# Altium schematic sheet Power.SchDoc
size A; SheetNumber: 1; SheetTotal: 4
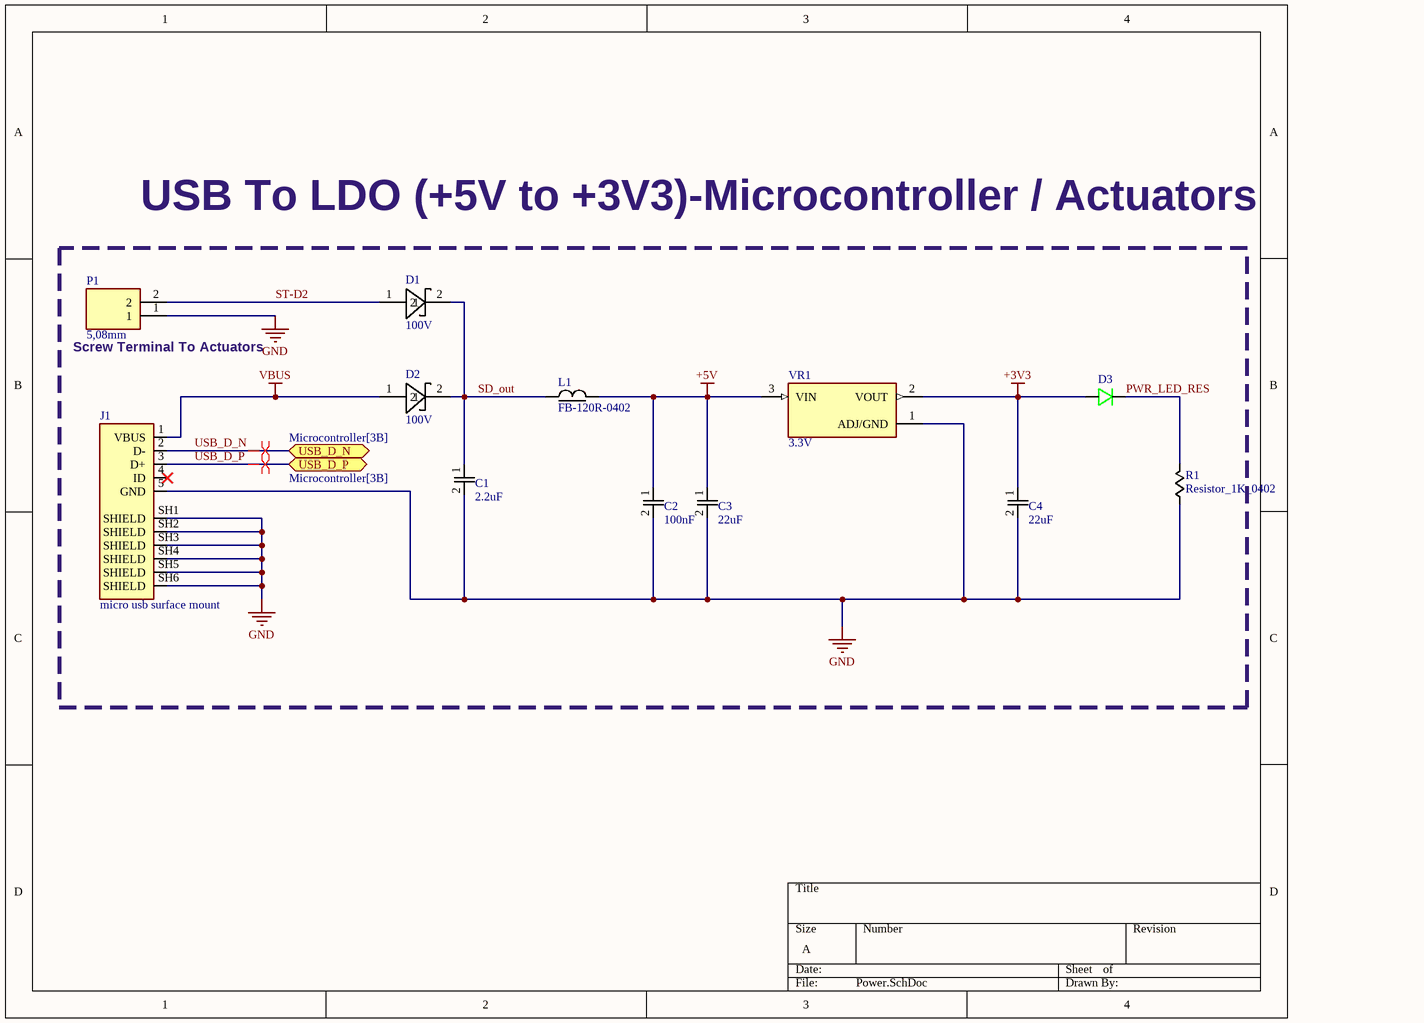
[diagram p0: Power.SchDoc]

## Parts
C1  2.2uF  [CAPC1005X55N]
C2  100nF  [CAPC1005X55N]
C3  22uF  [CAPC1005X55N]
C4  22uF  [CAPC1005X55N]
D1  100V  [Schottky.D]
D2  100V  [Schottky.D]
D3  Green LED 0805  [LED_APT2012MGC]  (value not drawn)
J1  micro usb surface mount  [TE_1981568-1]
L1  FB-120R-0402  [RESC1005X40N]
P1  5,08mm  [Screw_terminal_block_5.0]
R1  Resistor_1K_0402  [RESC1005X40N]
VR1  3.3V  [SOT229P700X180-4N]

## Blocks framed on the sheet
Screw Terminal To Actuators: C1-C4 D1-D3 J1 L1 P1 R1 VR1

## Ports
USB_D_N (bidir, see Microcontroller[3B]), USB_D_P (bidir, see Microcontroller[3B])

## Nets
+3V3: C4.1 D3.A VR1.2(VOUT)
+5V: C2.1 C3.1 L1.2 VR1.3(VIN)
GND: C1.2 C2.2 C3.2 C4.2 J1.5(GND) J1.SH1(SHIELD) J1.SH2(SHIELD) J1.SH3(SHIELD) J1.SH4(SHIELD) J1.SH5(SHIELD) J1.SH6(SHIELD) P1.1 R1.1 VR1.1(ADJ/GND)
VBUS: D2.1 J1.1(VBUS)
PWR_LED_RES: D3.C R1.2
SD_out: C1.1 D1.2 D2.2 L1.1
ST-D2: D1.1 P1.2
USB_D_N: J1.2(D-) ; port USB_D_N
USB_D_P: J1.3(D+) ; port USB_D_P

Not connected (* = marked no-connect by the designer): J1 4(ID)*

## Layout directives
differential pair: USB_D_N, USB_D_P

## Notes on the sheet
- USB To LDO (+5V to +3V3)-Microcontroller / Actuators

## Library data of the parts
C1 = Cap_2.2uF_0402: CAP CER 2.2uF 16V X5R 0402; Manufacturer: Samsung Electro-Mechanics; Manufacturer Part #: CL05A225KO5NQNC; Supplier: LCSC; Supplier Part#: C170151; ComponentLink1Description: Data Sheet; ComponentLink1URL: https://www.lcsc.com/datasheet/C170151.pdf?spm=wm.sxq.inf.ggs___wm.fly.bg.3.stp&lcsc_vid=T1MKV1cAE1gLBAVfTgIKUgJfTlkPBQBVQlMMBAJURwAxVlNeT1dfVlxVQ1ReXzsOAxUeFF5JWBYZEEoKFBINSQcJGk4%3D
C2 = Cap_100nF_0402: CAP CER 100nF 16V X7R 0402; Manufacturer: Samsung Electro-Mechanics; Manufacturer Part #: CL05B104KO5NNNC; Supplier: LCSC; Supplier Part#: C1525; ComponentLink1Description: Data Sheet; ComponentLink1URL: https://www.lcsc.com/datasheet/C1525.pdf?spm=wm.sxq.inf.ggs___wm.fly.bg.1.stp&lcsc_vid=T1MKV1cAE1gLBAVfTgIKUgJfTlkPBQBVQlMMBAJURwAxVlNeT1dfVlxVQ1ReXzsOAxUeFF5JWBYZEEoKFBINSQcJGk4%3D
C3 C4 = Cap_22uF_0402: CAP CER 22uF 6.3V X5R 0402; Manufacturer: Samsung Electro-Mechanics; Manufacturer Part #: CL05A226MQ5QUNC; Supplier: LCSC; Supplier Part#: C105226; ComponentLink1Description: Data Sheet; ComponentLink1URL: https://www.lcsc.com/datasheet/C105226.pdf?spm=wm.sxq.inf.ggs___wm.fly.bg.3.stp&lcsc_vid=T1MKV1cAE1gLBAVfTgIKUgJfTlkPBQBVQlMMBAJURwAxVlNeT1dfVlxVQ1ReXzsOAxUeFF5JWBYZEEoKFBINSQcJGk4%3D
D1 D2 = Schottky_D: 100V 850mV@5A 5A SMAG Schottky Diodes ROHS; Manufacturer: Nexperia; Mfr. Part #: BAT54S,215; Splr.part#: C466506; Supplier: LCSC; ComponentLink1Description: New link; ComponentLink1URL: https://www.lcsc.com/product-detail/C466506.html?s_z=n_schottky%2520diode
D3 = Green LED 0805: LED GREEN 0805 SMD; Manufacturer: NATIONSTAR; Manufacturer Part#: NCD0805G1; Supplier: LCSC; Supplier Part#: C84260; ComponentLink1Description: Data Sheet; ComponentLink1URL: https://www.lcsc.com/datasheet/C84260.pdf?spm=wm.sxq.inf.ggs___wm.fly.bg.0.stp&lcsc_vid=FVIKU1JeEVJYVVVSQVdZUQJSQlYKVAJXRwQLV1VXQlYxVlNeQVdfUV1TQ1ReXzsOAxUeFF5JWBYZEEoKFBINSQcJGk4NBhADEA4cHktXRlVcSQwSGg0%3D
J1 = micro usb surface mount: MICRO USB, TYPE B,; Manufacturer: HMTCONN; Manufacturer Part#: HMT-MICRO USB 4P; Supplier: LCSC; Supplier Part#: C53121381; ComponentLink1Description: Data Sheet; ComponentLink1URL: https://www.lcsc.com/datasheet/C53121381.pdf?spm=wm.sxq.inf.ggs___wm.ssy.bg.2.stp&lcsc_vid=RlgPBF0EEVEPX1ZVRAVZVwcHRVJaBVJSTlNXAgBWFlkxVlNeQFFbX1NTQ1dfVzsOAxUeFF5JWBYZEEoKFBINSQcJGk4eFQsCAgIaSgADAwAHC0slT1VdUFJIHxUDCw%3D%3D
L1 = FB-120R-0402: FERRITE BEAD 120Ω 0402; Manufacturer: KOHERelec; Manufacturer Part#: FBHA0402-121-202R; Supplier: LCSC; Supplier Part#: C41355350; ComponentLink1Description: Data Sheet; ComponentLink1URL: https://www.lcsc.com/datasheet/C41355350.pdf?spm=wm.sxq.inf.ggs___wm.fly.bg.5.stp&lcsc_vid=T1MKV1cAE1gLBAVfTgIKUgJfTlkPBQBVQlMMBAJURwAxVlNeT1dcVldXR1JYUjsOAxUeFF5JWBYZEEoKFBINSQcJGk4NBhADEA4cHktXRlZeSQwSGg0%3D
P1 = screw terminal block 2 port: 1x2P 18A -40℃~+105℃ 250V Green 14~30 Through Hole 5.08mm 2.5 1 2 Through Hole,P=5.08mm Screw Terminal Blocks ROHS; Manufacturer: KANGNEX; Mfr. Part #: WJ500V-5.08-2P; Splr.part#: C8465; Supplier: LCSC; ComponentLink1Description: New link; ComponentLink1URL: https://www.lcsc.com/product-detail/C8465.html
R1 = Resistor_1K_0402: 1kOhms Â±1% 0.063W, 1/16W Chip Resistor 0402 (1005 Metric) Moisture Resistant Thick Film; Manufacturer: FOJAN; Manufacturer Part #: RC0402FR-071KL; Supplier: LCSC; Supplier Part #: C106235; ComponentLink1Description: Data Sheet; ComponentLink1URL: https://www.lcsc.com/datasheet/C106235.pdf?spm=wm.sxq.inf.ggs___wm.fly.bg.2.stp&lcsc_vid=T1MKV1cAE1gLBAVfTgIKUgJfTlkPBQBVQlMMBAJURwAxVlNeT1dcVlJVRFlZVzsOAxUeFF5JWBYZEEoKFBINSQcJGk4NBhADEA4cHktXRlhXSQwSGg0%3D
VR1 = AMS1117_3.3: 72dB@(120Hz) 1A Fixed 3.3V Positive 16V SOT-223 Voltage Regulators - Linear, Low Drop Out (LDO) Regulators ROHS; Manufacturer: Advanced Monolithic Systems; Mfr. Part #: AMS1117-3.3; Splr.part#: C6186; Supplier: LCSC; ComponentLink1Description: New link; ComponentLink1URL: https://www.lcsc.com/product-detail/C6186.html?s_z=n_ASM1117